# Altium project CW308T_EMF32GG11.PrjPcb
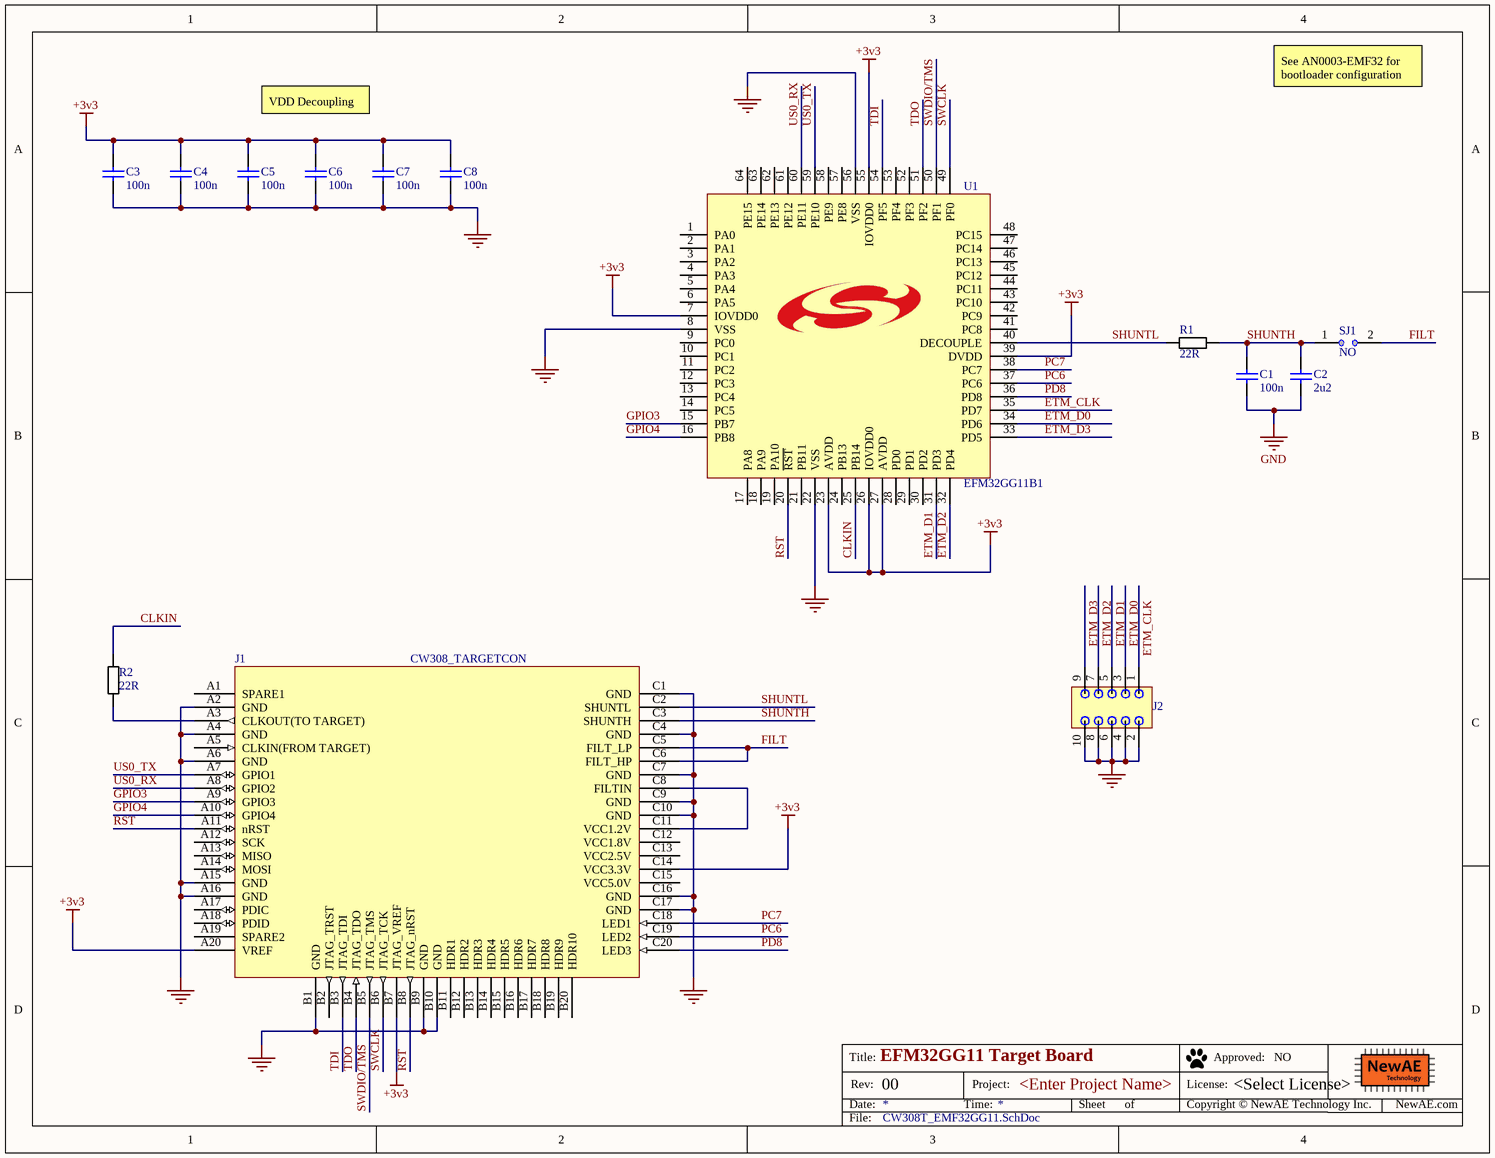
[diagram p0: CW308T_EMF32GG11.SchDoc]
PrjLicense: <Select License>; PrjName: <Enter Project Name>; PrjRev: 00
1 sheet, 14 parts. Net scope: global (net labels, ports and power ports of the same name join across sheets).
Board file: CW308T_EMF32GG11.PcbDoc

## Sheet CW308T_EMF32GG11.SchDoc: EFM32GG11 Target Board
size Letter; Organization: NewAE Technology Inc.; Address1: 1083 Queen St., Suite 196; Address2: Halifax; Address3: NS; Address4: Canada B3H 0B2; SheetApproved: NO

### Parts
C1  100n  [CAPC0603_M]
C2  2u2  [CAPC0603_M]
C3  100n  [CAPC0603_M]
C4  100n  [CAPC0603_M]
C5  100n  [CAPC0603_M]
C6  100n  [CAPC0603_M]
C7  100n  [CAPC0603_M]
C8  100n  [CAPC0603_M]
J1  CW308_TARGETCON  [CW308_TBOARD_CONN]
J2  1296-T10  [1296-T10]  (value not drawn)
R1  22R  [RESC1608X55N]
R2  22R  [RESC1608X55N]
SJ1  NO  [SJ_2S_NO]  (no BOM)
U1  EFM32GG11B1  [TQFP50P1200X1200X120-64N]

### Nets
+3v3: C3.1 C4.1 C5.1 C6.1 C7.1 C8.1 J1.A20(VREF) J1.B7(JTAG_VREF) J1.C14(VCC3.3V) U1.7(IOVDD0) U1.23(AVDD) U1.26(IOVDD0) U1.27(AVDD) U1.39(DVDD) U1.55(IOVDD0)
GND: C1.2 C2.2 C3.2 C4.2 C5.2 C6.2 C7.2 C8.2 J1.A2(GND) J1.A4(GND) J1.A6(GND) J1.A15(GND) J1.A16(GND) J1.B1(GND) J1.B9(GND) J1.B10(GND) J1.C1(GND) J1.C4(GND) J1.C7(GND) J1.C9(GND) J1.C10(GND) J1.C16(GND) J1.C17(GND) J2.2 J2.4 J2.6 J2.8 J2.10 U1.8(VSS) U1.22(VSS) U1.56(VSS)
CLKIN: R2.1 U1.25(PB14)
ETM_CLK: J2.1 U1.35(PD7)
ETM_D0: J2.3 U1.34(PD6)
ETM_D1: J2.5 U1.31(PD3)
ETM_D2: J2.7 U1.32(PD4)
ETM_D3: J2.9 U1.33(PD5)
FILT: J1.C5(FILT_LP) J1.C6(FILT_HP) SJ1.2
GPIO3: J1.A9(GPIO3) U1.15(PB7)
GPIO4: J1.A10(GPIO4) U1.16(PB8)
PC6: J1.C19(LED2) U1.37(PC6)
PC7: J1.C18(LED1) U1.38(PC7)
PD8: J1.C20(LED3) U1.36(PD8)
RST: J1.A11(nRST) J1.B8(JTAG_nRST) U1.20(~{RST})
SHUNTH: C1.1 C2.1 J1.C3(SHUNTH) R1.2 SJ1.1
SHUNTL: J1.C2(SHUNTL) R1.1 U1.40(DECOUPLE)
SWCLK: J1.B6(JTAG_TCK) U1.49(PF0)
SWDIO/TMS: J1.B5(JTAG_TMS) U1.50(PF1)
TDI: J1.B3(JTAG_TDI) U1.54(PF5)
TDO: J1.B4(JTAG_TDO) U1.51(PF2)
US0_RX: J1.A8(GPIO2) U1.60(PE11)
US0_TX: J1.A7(GPIO1) U1.59(PE10)
NetJ1_A3: J1.A3(CLKOUT(TO_TARGET)) R2.2
NetJ1_C8: J1.C8(FILTIN) J1.C11(VCC1.2V)

Not connected (* = marked no-connect by the designer): J1 A1(SPARE1) A5(CLKIN(FROM_TARGET)) A12(SCK) A13(MISO) A14(MOSI) A17(PDIC) A18(PDID) A19(SPARE2) B2(JTAG_TRST) B11(HDR1) B12(HDR2) B13(HDR3) B14(HDR4) B15(HDR5) B16(HDR6) B17(HDR7) B18(HDR8) B19(HDR9) B20(HDR10) C12(VCC1.8V) C13(VCC2.5V) C15(VCC5.0V); U1 1(PA0) 2(PA1) 3(PA2) 4(PA3) 5(PA4) 6(PA5) 9(PC0) 10(PC1) 11(PC2) 12(PC3) 13(PC4) 14(PC5) 17(PA8) 18(PA9) 19(PA10) 21(PB11) 24(PB13) 28(PD0) 29(PD1) 30(PD2) 41(PC8) 42(PC9) 43(PC10) 44(PC11) 45(PC12) 46(PC13) 47(PC14) 48(PC15) 52(PF3) 53(PF4) 57(PE8) 58(PE9) 61(PE12) 62(PE13) 63(PE14) 64(PE15)

### Notes on the sheet
- See AN0003-EMF32 for bootloader configuration
- VDD Decoupling
- Title:
- Date:
- Rev:
- Time:
- Project:
- Sheet
- of
- License:
- Copyright © NewAE Technology Inc.
- Approved:
- NewAE.com
- File:

### Library data of the parts
C1 C3-C8 = CCHIP-100n-0603: 100n, 0603; Manufacture 1: Kemet; Manufacture Part Number 1: C0603C104K5RACTU; Component Group: Capacitor; Case-EIA: 0603; Case-Metric: 1608; Rated Voltage: 50VDC; Part Number: CCHIP-100n-0603; Footprint: 0603; Pin Count: 2; Supplier 1: Digi-Key; Supplier Part Number 1: 399-5089-2-ND; Value: 100n; Mounting Technology: SMT; Component Kind: Standard; Component Type: Standard
C2 = CCHIP-2u2-0603: 2u2, 0603; Manufacture 1: Samsung; Manufacture Part Number 1: CL10B225KP8NNNC; Component Group: Capacitor; Case-EIA: 0603; Case-Metric: 1608; Rated Voltage: 10VDC; Part Number: CCHIP-2u2-0603; Footprint: 0603; Pin Count: 2; Supplier 1: Digi-Key; Supplier Part Number 1: 1276-1134-2-ND; Value: 2u2; Mounting Technology: SMT; Component Kind: Standard; Component Type: Standard
J1 = CW308_TBOARD: CW308 "Standard" Target Board Connector; Component Group: Mechanical; Pitch: 2.54mm; Part Number: CW308_TBOARD; Pin Count: 60; Mounting Technology: Through-hole; Component Kind: Standard; Component Type: Standard
J2 = 1296-T10: Header, 10-pin, SMD, 0.05"; Manufacture Part Number 1: 20021121-00010C4LF; Component Group: Connector; Part Number: 1296-T10; Pin Count: 10; Supplier 1: Digi-Key; Supplier Part Number 1: 609-3695-1-ND; Mounting Technology: SMT; Component Kind: Standard; Component Type: Standard
R1 R2 = RCHIP-22R-0603: 22R res, 0603, 1%, 1/10W; Manufacture 1: Yageo; Manufacture Part Number 1: RC0603FR-0722RL; Component Group: Resistor; Case-EIA: 0603; Case-Metric: 1608; Rated Power: 0.1W; Rated Voltage: 75VDC; Part Number: RCHIP-22R-0603; Footprint: 0603; Pin Count: 2; Supplier 1: Digi-Key; Supplier Part Number 1: 311-22.0HRCT-ND; Value: 22R; Tolerance: 1%; Mounting Technology: SMT; Temperature Range: -55C to 155C; Component Kind: Standard; Component Type: Standard
SJ1 = SJ_2S_NO: Solder Jumper, NO; Component Group: PCB Feature; Part Number: SJ_2S_NO; Pin Count: 2; Mounting Technology: COPPER; Component Type: Standard (No BOM)
U1 = EFM32GG11B1: MCU Giant Gecko 11 Ultra Low Power MCU, Cortex-M4 72MHz QFP64 2048kB(Flash) 512kB(RAM) 53GPIO; Manufacture 1: Silicon Labs; Manufacture Part Number 1: EFM32GG11B120F2048GQ64-A; Component Group: Digital IC; PP Material Stack: 0; Part Number: EFM32GG11B1; Footprint: 64TQFP; Pin Count: 64; Supplier 1: Mouser; Supplier Part Number 1: 634-11120F2048GQ64; Mounting Technology: SMT; RoHS: Yes; Component Kind: Standard; Component Type: Standard; PP Rotation: 0